# Altium schematic sheet Sheet1.SchDoc
size A3; Organization: Altium Limited; Address1: L3, 12a Rodborough Rd; Address2: Frenchs Forest; Address3: NSW; Address4: Australia 2086; SheetNumber: 1; SheetTotal: 1
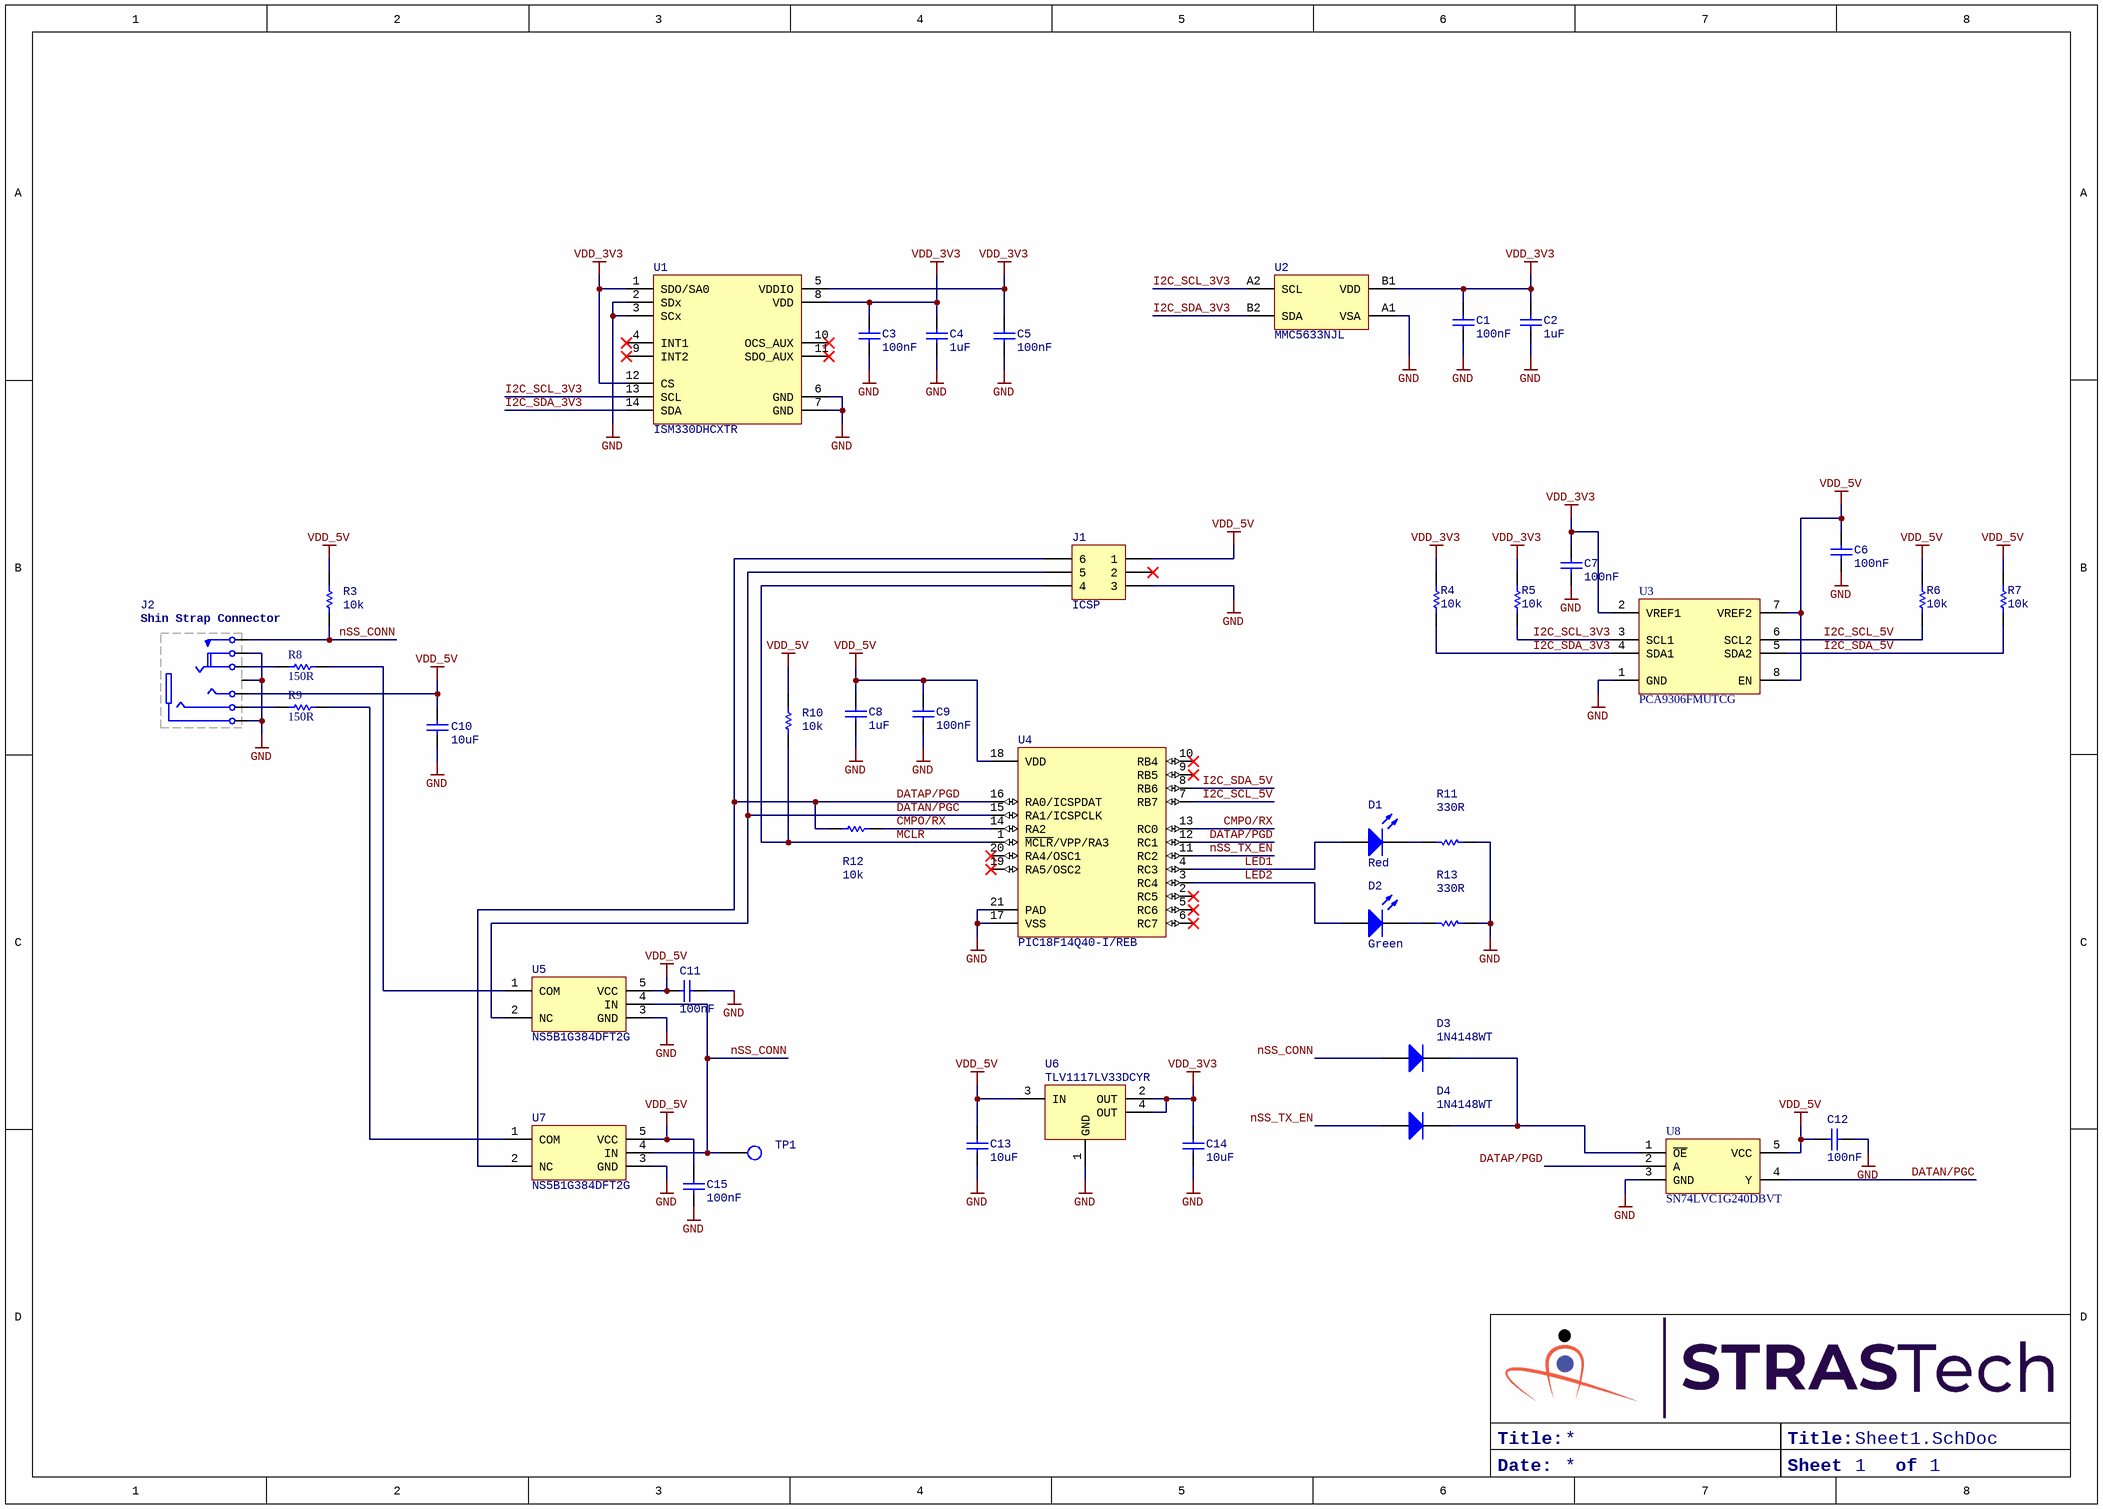
[diagram p0: Sheet1.SchDoc]

## Parts
C1  100nF  [Cap,SMD,0402]
C2  1uF  [Cap,SMD,0402]
C3  100nF  [Cap,SMD,0402]
C4  1uF  [Cap,SMD,0402]
C5  100nF  [Cap,SMD,0402]
C6  100nF  [Cap,SMD,0402]
C7  100nF  [Cap,SMD,0402]
C8  1uF  [Cap,SMD,0402]
C9  100nF  [Cap,SMD,0402]
C10  10uF  [Cap,SMD,0402]
C11  100nF  [Cap,SMD,0402]
C12  100nF  [Cap,SMD,0402]
C13  10uF  [Cap,SMD,0402]
C14  10uF  [Cap,SMD,0402]
C15  100nF  [Cap,SMD,0402]
D1  Red  [LED,0603]
D2  Green  [LED,0603]
D3  1N4148WT  [SOD523]
D4  1N4148WT  [SOD523]
J1  Term,Header,3x2 Pin,1.27mm,SMD  [TERM,HEADER,3X2PIN,P1.27,SMD]  (value not drawn)
J2  Conn,Jack,TRS,3.5mm,Thru,Shielded  [Conn,Jack,TRS,3.5mm,Thru,Shielded]  (value not drawn)
R3  10k  [RES,0402]
R4  10k  [RES,0402]
R5  10k  [RES,0402]
R6  10k  [RES,0402]
R7  10k  [RES,0402]
R8  150R  [RES,0402]
R9  150R  [RES,0402]
R10  10k  [RES,0402]
R11  330R  [RES,0402]
R12  10k  [RES,0402]
R13  330R  [RES,0402]
TP1  TESTPOINT  [testpoint,smd,round,1mm]  (value not drawn)
U1  ISM330DHCXTR  [IC,LGA-14L,2.5x3mm]
U2  MMC5633NJL  [IC,WLP,2x2,P0.4mm]
U3  PCA9306FMUTCG  [IC,UDFN-8,P0.35]
U4  PIC18F14Q40-I/REB  [IC,QFN-20,3x3,PAD,P0.4]
U5  NS5B1G384DFT2G  [SC70-5]
U6  TLV1117LV33DCYR  [SOT223]
U7  NS5B1G384DFT2G  [SC70-5]
U8  SN74LVC1G240DBVT  [sot23-5]

## Nets
GND: C1.2 C2.1 C3.1 C4.1 C5.1 C6.2 C7.2 C8.1 C9.1 C10.1 C11.2 C12.1 C13.1 C14.1 C15.1 J1.3 J2.0(SH) J2.1(S) J2.5(IR1) R11.1 R13.1 U1.2(SDx) U1.3(SCx) U1.6(GND) U1.7(GND) U2.A1(VSA) U3.1(GND) U4.17(VSS) U4.21(PAD) U5.3(GND) U6.1(GND) U7.3(GND) U8.3(GND)
VDD_3V3: C1.1 C2.2 C3.2 C4.2 C5.2 C7.1 C14.2 R4.2 R5.2 U1.1(SDO/SA0) U1.5(VDDIO) U1.8(VDD) U1.12(CS) U2.B1(VDD) U3.2(VREF1) U6.2(OUT) U6.4(OUT)
VDD_5V: C6.1 C8.2 C9.2 C10.2 C11.1 C12.2 C13.2 C15.2 J1.1 J2.2(T) R3.2 R6.2 R7.2 R10.2 U3.7(VREF2) U3.8(EN) U4.18(VDD) U5.5(VCC) U6.3(IN) U7.5(VCC) U8.5(VCC)
CMPO/RX: R12.1 U4.13(RC0) U4.14(RA2)
DATAN/PGC: J1.5 U4.15(RA1/ICSPCLK) U5.2(NC) U8.4(Y)
DATAP/PGD: J1.6 R12.2 U4.12(RC1) U4.16(RA0/ICSPDAT) U7.2(NC) U8.2(A)
I2C_SCL_3V3: R5.1 U1.13(SCL) U2.A2(SCL) U3.3(SCL1)
I2C_SCL_5V: R6.1 U3.6(SCL2) U4.7(RB7)
I2C_SDA_3V3: R4.1 U1.14(SDA) U2.B2(SDA) U3.4(SDA1)
I2C_SDA_5V: R7.1 U3.5(SDA2) U4.8(RB6)
LED1: D1.1(A) U4.4(RC3)
LED2: D2.1(A) U4.3(RC4)
~{MCLR}: J1.4 R10.1 U4.1(~{MCLR}/VPP/RA3)
nSS_CONN: D3.2(A) J2.6(R1S) R3.1 TP1.1(TP) U5.4(IN) U7.4(IN)
nSS_TX_EN: D4.2(A) U4.11(RC2)
NetD1_2: D1.2(K) R11.2
NetD2_2: D2.2(K) R13.2
NetD3_1: D3.1(K) D4.1(K) U8.1(~{OE})
NetJ2_3: J2.3(R1) R8.1
NetJ2_4: J2.4(R2) R9.1
NetR8_2: R8.2 U5.1(COM)
NetR9_2: R9.2 U7.1(COM)

Not connected (* = marked no-connect by the designer): J1 2*; U1 4(INT1)* 9(INT2)* 10(OCS_AUX)* 11(SDO_AUX)*; U4 2(RC5)* 5(RC6)* 6(RC7)* 9(RB5)* 10(RB4)* 19(RA5/OSC2)* 20(RA4/OSC1)*

## Notes on the sheet
- (near J2) Shin Strap Connector
- (near J1) ICSP
- Title:
- Date:
- Sheet
- of
- Title
- Size:
- A3
- Revision:
- Design By:

## Library data of the parts
C1 C3 C5-C7 C9 C11 C12 C15 = CAP,Cer,100nF,25VDC,X7R,0402: 0.1µF ±10% 25V Ceramic Capacitor X7R 0402 (1005 Metric); Vendor Part Number: 490-14603-1-ND; Manufacturer: Murata Electronics; Manufacturer Part Number: GRM155R71E104KE14J; Vendor: Digikey; HelpURL: https://search.murata.co.jp/Ceramy/image/img/A01X/G101/ENG/GRM155R71E104KE14-01.pdf; CreatedBy: Judd Foster
C2 C4 C8 = CAP,Cer,1uF,35VDC,X5R,0402: 1 µF ±10% 35V Ceramic Capacitor X5R 0402 (1005 Metric); Vendor Part Number: 445-9073-1-ND; Manufacturer: TDK Corporation; Manufacturer Part Number: C1005X5R1V105K050BC; Vendor: Digikey; HelpURL: https://product.tdk.com/info/en/catalog/datasheets/mlcc_commercial_general_en.pdf?ref_disty=digikey; CreatedBy: Judd Foster
C10 C13 C14 = CAP,Cer,10uF,10VDC,X5R,0402: 10 µF ±20% 10V Ceramic Capacitor X5R 0402 (1005 Metric); Vendor Part Number: 1276-1450-1-ND; Manufacturer: Samsung Electro-Mechanics; Manufacturer Part Number: CL05A106MP5NUNC; Vendor: Digikey; HelpURL: https://media.digikey.com/pdf/Data%20Sheets/Samsung%20PDFs/CL05A106MP5NUNC_Spec.pdf; CreatedBy: Judd Foster
D1 = LED,Red,SMD,0603: Red 633nm LED Indication - Discrete 2V 0603 (1608 Metric); Manufacturer: Lite-On Inc.; Manufacturer Part Number: LS Q976-NR-1; Vendor Part Number: 475-2512-1-ND; Vendor: Digikey; CreatedBy: Judd Foster; HelpURL: https://dammedia.osram.info/media/resource/hires/osram-dam-2493499/LS%20Q976.pdf
D2 = LED,Green,SMD,0603: Green 530nm LED Indication - Discrete 3V 0603 (1608 Metric); Manufacturer: Stanley Electric Co; Manufacturer Part Number: THG1111C-0005-TR; Vendor Part Number: 404-1286-1-ND; Vendor: Digikey; CreatedBy: Judd Foster; HelpURL: http://www.stanley-components.com/php/downloaddatafile.php?rp=0,THG1111C-0005_e.pdf
D3 D4 = DIODE,Gen,75V,200mA,SOD523F: Diode Standard 75 V 200mA Surface Mount SOD-523F; Manufacturer: ON Semiconductor; Vendor Part Number: 1N4148WTCT-ND; Vendor: Digikey; CreatedBy: Judd Foster; HelpURL: https://rocelec.widen.net/view/pdf/bnxdzepaue/ONSM-S-A0003584797-1.pdf?t.download=true&u=5oefqw; Manufacturer Part Number: 1N4148WT
J1 = Term,Header,3x2 Pin,1.27mm,SMD: Connector Header Surface Mount 6 position 0.050" (1.27mm); Vendor Part Number: 609-3693-1-ND; Manufacturer: Amphenol ICC (FCI); Manufacturer Part Number: 20021121-00006C4LF; Vendor: Digikey; HelpURL: https://media.digikey.com/pdf/Data%20Sheets/FCI%20PDFs/Minitek%20127_Catalog.pdf; CreatedBy: Judd Foster
J2 = Conn,Jack,TRS,3.5mm,Thru,Shielded: 3.50mm (0.141", 1/8", Mini Plug) - Headphone Phone Jack Stereo (4 Conductor, TRRS) Connector Solder; Manufacturer: CUI Devices; Manufacturer Part Number: SJ-435107RS; Vendor Part Number: CP-435107RS-ND; Vendor: Digikey; CreatedBy: Judd Foster; HelpURL: https://www.cuidevices.com/product/resource/digikeypdf/sj-435107.pdf
R3-R7 R10 R12 = RES,10k,5%,0.063W,0402: 10 kOhms ±5% 0.063W, 1/16W Chip Resistor 0402 (1005 Metric) Automotive AEC-Q200 Thick Film; Vendor Part Number: RMCF0402JT10K0CT-ND; Manufacturer: Stackpole Electronics Inc; Manufacturer Part Number: RMCF0402JT10K0; Vendor: DIgikey; HelpURL: https://www.seielect.com/catalog/sei-rmcf_rmcp.pdf; CreatedBy: Judd Foster
R8 R9 = RES,150R,1%,0.1W,0402: 150 Ohms ±1% 0.063W, 1/16W Chip Resistor 0402 (1005 Metric) Automotive AEC-Q200, Moisture Resistant Thick Film; Manufacturer: TE Connectivity Passive Product; Manufacturer Part Number: CRGCQ0402F150R; Vendor Part Number: A129617CT-ND; Vendor: Digikey; CreatedBy: Judd Foster; HelpURL: https://www.te.com/commerce/DocumentDelivery/DDEController?Action=srchrtrv&DocNm=1773204-3&DocType=DS&DocLang=English
R11 R13 = RES,330R,5%,0.063W,0402: 330 Ohms ±5% 0.063W, 1/16W Chip Resistor 0402 (1005 Metric) Automotive AEC-Q200 Thick Film; Manufacturer: Stackpole Electronics Inc; Manufacturer Part Number: RMCF0402JT330R; Vendor Part Number: RMCF0402JT330RCT-ND; Vendor: Digikey; CreatedBy: Judd Foster; HelpURL: https://www.seielect.com/catalog/sei-rmcf_rmcp.pdf
TP1 = TESTPOINT: PCB Testpoint; CreatedBy: Judd Foster; HelpURL: N/A; Manufacturer: N/A; Manufacturer Part Number: N/A; Vendor: N/A; Vendor Part Number: N/A
U1 = ISM330DHCXTR: Accelerometer, Gyroscope, Temperature, 6 Axis Sensor I²C, SPI Output; Manufacturer: STMicroelectronics; Vendor Part Number: 497-19784-1-ND; Vendor: Digikey; CreatedBy: Judd Foster; HelpURL: https://www.st.com/resource/en/datasheet/ism330dhcx.pdf; Manufacturer Part Number: ISM330DHCXTR
U2 = MMC5633NJL: Magnetoresistive Sensor X, Y, Z Axis 4-WLP (0.85x0.85); Manufacturer: Memsic Inc.; Vendor Part Number: 1267-MMC5633NJLCT-ND; Vendor: Digikey; CreatedBy: Judd Foster; HelpURL: https://media.digikey.com/pdf/Data%20Sheets/MEMSIC%20PDFs/MMC5633NJL_RevA_3-12-20.pdf; Manufacturer Part Number: MMC5633NJL
U3 = PCA9306FMUTCG: Voltage Level Translator Bidirectional 1 Circuit 2 Channel 8-UDFN (1.45x1); Manufacturer: onsemi; Vendor Part Number: PCA9306FMUTCGOSCT-ND; Vendor: Digikey; CreatedBy: Judd Foster; HelpURL: https://www.onsemi.com/pdf/datasheet/pca9306-d.pdf; Manufacturer Part Number: PCA9306FMUTCG
U4 = PIC18F14Q40-I/REB: PIC series Microcontroller IC 8-Bit 64MHz 16KB (16K x 8) FLASH 20-VQFN (3x3); Manufacturer: Microchip Technology; Vendor Part Number: 150-PIC18F14Q40-I/REB-ND; Vendor: Digikey; CreatedBy: Judd Foster; HelpURL: https://ww1.microchip.com/downloads/en/DeviceDoc/PIC18F04-05-14-15-Q40-1420-Pin-Low-Power-High-Performance-Microcontroller-With-XLP-Technology-Data-Sheet-40002236B.pdf; Manufacturer Part Number: PIC18F14Q40-I/REB
U5 U7 = NS5B1G384DFT2G: 1 Circuit IC Switch 1:1 15Ohm SC-88A (SC-70-5/SOT-353); Manufacturer: onsemi; Vendor Part Number: NS5B1G384DFT2GOSCT-ND; Vendor: Digikey; CreatedBy: Judd Foster; HelpURL: https://www.onsemi.com/pdf/datasheet/ns5b1g384-d.pdf; Manufacturer Part Number: NS5B1G384DFT2G
U6 = TLV1117LV33DCYR: Linear Voltage Regulator IC  1 Output  1A SOT-223-4; Manufacturer: Texas Instruments; Vendor Part Number: 296-28778-1-ND; Vendor: Digikey; CreatedBy: Judd Foster; HelpURL: http://www.ti.com/lit/ds/symlink/tlv1117lv.pdf; Manufacturer Part Number: TLV1117LV33DCYR
U8 = SN74LVC1G240DBVT: Buffer, Inverting 1 Element 1 Bit per Element 3-State Output SOT-23-5; Vendor Part Number: 296-32301-1-ND; Manufacturer: Texas Instruments; Vendor: Digikey; HelpURL: https://www.ti.com/general/docs/suppproductinfo.tsp?distId=10&gotoUrl=https%3A%2F%2Fwww.ti.com%2Flit%2Fgpn%2Fsn74lvc1g240; Manufacturer Part Number: SN74LVC1G240DBVT; CreatedBy: Judd Foster